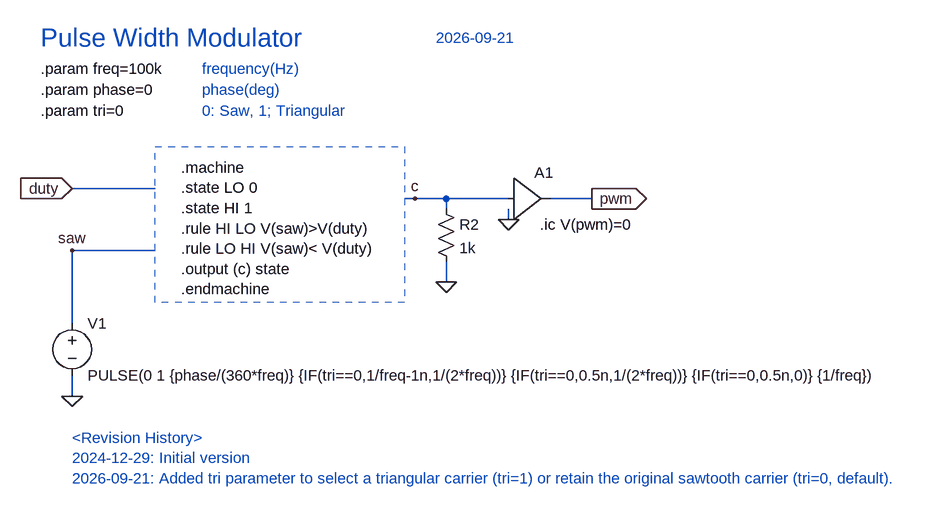
[diagram p0: schematic PWM.asc]
PWM.asc, the LTspice schematic file:
Version 4.1
SHEET 1 1668 1312
WIRE 32 64 -96 64
WIRE 432 80 416 80
WIRE 480 80 432 80
WIRE 576 80 480 80
WIRE 704 80 640 80
WIRE 480 96 480 80
WIRE 576 112 576 96
WIRE 32 160 -96 160
WIRE 480 208 480 176
WIRE -96 272 -96 160
WIRE -96 384 -96 352
FLAG -96 64 duty
IOPIN -96 64 In
FLAG 704 80 pwm
IOPIN 704 80 Out
FLAG 480 208 0
FLAG 432 80 c
FLAG 576 112 0
FLAG -96 384 0
FLAG -96 160 saw
SYMBOL res 464 80 R0
SYMATTR InstName R2
SYMATTR Value 1k
SYMBOL Digital\\buf1 576 16 R0
SYMATTR InstName A1
SYMBOL voltage -96 256 R0
WINDOW 123 0 0 Left 0
WINDOW 39 0 0 Left 0
SYMATTR InstName V1
SYMATTR Value PULSE(0 1 {phase/(360*freq)} {IF(tri==0,1/freq-1n,1/(2*freq))} {IF(tri==0,0.5n,1/(2*freq))} {IF(tri==0,0.5n,0)} {1/freq})
TEXT 72 32 Left 2 !.machine\n.state LO 0\n.state HI 1\n.rule HI LO V(saw)>V(duty)\n.rule LO HI V(saw)< V(duty)\n.output (c) state\n.endmachine
TEXT -144 -120 Left 2 !.param freq=100k
TEXT 624 120 Left 2 !.ic V(pwm)=0
TEXT -144 -88 Left 2 !.param phase=0
TEXT -144 -168 Left 4 ;Pulse Width Modulator
TEXT 464 -168 Left 2 ;2026-09-21
TEXT 104 -120 Left 2 ;frequency(Hz)
TEXT -144 -56 Left 2 !.param tri=0
TEXT 104 -56 Left 2 ;0: Saw, 1; Triangular
TEXT 104 -88 Left 2 ;phase(deg)
TEXT -96 448 Left 2 ;<Revision History>\n2024-12-29: Initial version\n2026-09-21: Added tri parameter to select a triangular carrier (tri=1) or retain the original sawtooth carrier (tri=0, default).
RECTANGLE Normal 416 240 32 0 2

The netlist it stands for:
* PWM.asc
R2 c 0 1k
A1 c 0 0 0 0 0 pwm 0 BUF
V1 saw 0 PULSE(0 1 {phase/(360*freq)} {IF(tri==0,1/freq-1n,1/(2*freq))} {IF(tri==0,0.5n,1/(2*freq))} {IF(tri==0,0.5n,0)} {1/freq})
.machine
.state LO 0
.state HI 1
.rule HI LO V(saw)>V(duty)
.rule LO HI V(saw)< V(duty)
.output (c) state
.endmachine
.param freq=100k
.ic V(pwm)=0
.param phase=0
* Pulse Width Modulator
* 2026-09-21
* frequency(Hz)
.param tri=0
* 0: Saw, 1; Triangular
* phase(deg)
* <Revision History>
* 2024-12-29: Initial version
* 2026-09-21: Added tri parameter to select a triangular carrier (tri=1) or retain the original sawtooth carrier (tri=0, default).
.backanno
.end